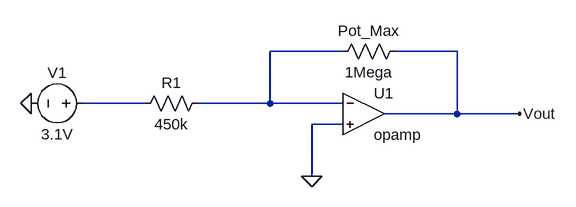
[diagram p0: schematic Draft1.asc]
Draft1.asc, the LTspice schematic file:
Version 4
SHEET 1 880 680
WIRE 144 96 32 96
WIRE 320 96 224 96
WIRE -160 176 -256 176
WIRE 32 176 32 96
WIRE 32 176 -80 176
WIRE 144 176 32 176
WIRE 320 192 320 96
WIRE 320 192 208 192
WIRE 416 192 320 192
WIRE 144 208 96 208
WIRE 96 288 96 208
FLAG -336 176 0
FLAG 96 288 0
FLAG 416 192 Vout
SYMBOL voltage -240 176 R90
WINDOW 0 -32 56 VBottom 2
WINDOW 3 32 56 VTop 2
SYMATTR InstName V1
SYMATTR Value 3.1V
SYMBOL res -64 160 R90
WINDOW 0 0 56 VBottom 2
WINDOW 3 32 56 VTop 2
SYMATTR InstName R1
SYMATTR Value 450k
SYMBOL res 240 80 R90
WINDOW 0 0 56 VBottom 2
WINDOW 3 32 56 VTop 2
SYMATTR InstName Pot_Max
SYMATTR Value 1Mega
SYMBOL Opamps\\opamp 176 128 R0
SYMATTR InstName U1

The netlist it stands for:
* Draft1.asc
V1 N002 0 3.1V
R1 N001 N002 450k
R§Pot_Max Vout N001 1Mega
XU1 N001 0 Vout opamp Aol=100K GBW=10Meg  ; pins invin noninvin out
.backanno
.end